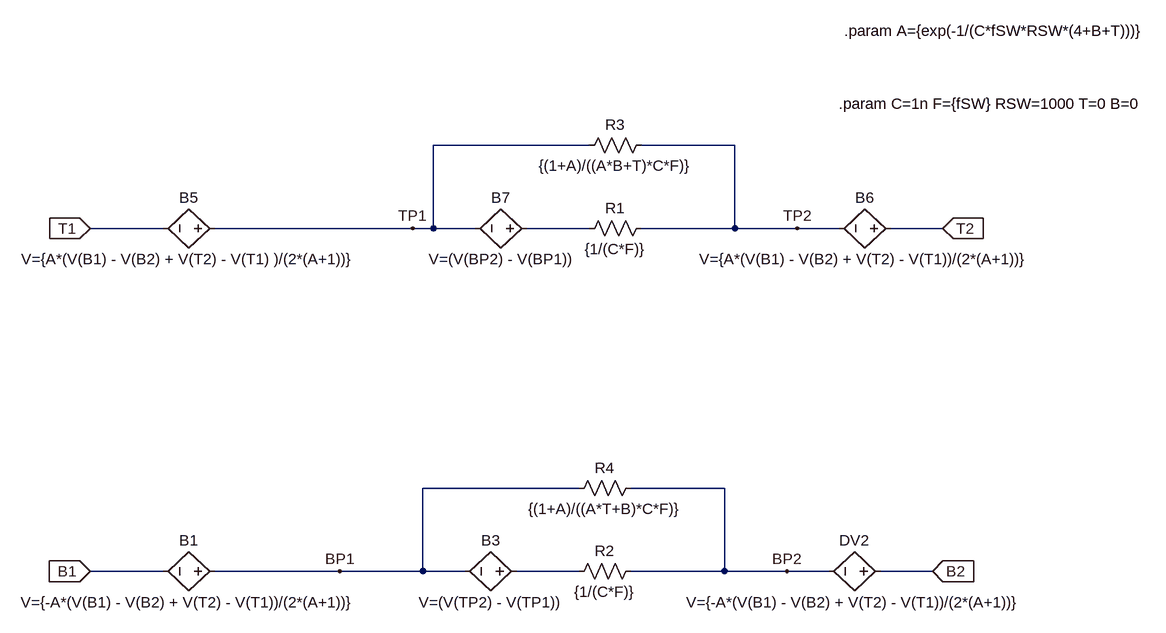
[diagram p0: schematic 4Term_Model.asc]
4Term_Model.asc, the LTspice schematic file:
Version 4
SHEET 1 2172 680
WIRE 352 -336 112 -336
WIRE 576 -336 432 -336
WIRE -304 -208 -416 -208
WIRE 80 -208 -224 -208
WIRE 112 -208 112 -336
WIRE 112 -208 80 -208
WIRE 176 -208 112 -208
WIRE 352 -208 256 -208
WIRE 576 -208 576 -336
WIRE 576 -208 432 -208
WIRE 672 -208 576 -208
WIRE 736 -208 672 -208
WIRE 896 -208 816 -208
WIRE 336 192 96 192
WIRE 560 192 416 192
WIRE -304 320 -416 320
WIRE -32 320 -224 320
WIRE 96 320 96 192
WIRE 96 320 -32 320
WIRE 160 320 96 320
WIRE 336 320 240 320
WIRE 560 320 560 192
WIRE 560 320 416 320
WIRE 656 320 560 320
WIRE 720 320 656 320
WIRE 880 320 800 320
FLAG -416 320 B1
IOPIN -416 320 In
FLAG 880 320 B2
IOPIN 880 320 In
FLAG 656 320 BP2
FLAG -32 320 BP1
FLAG -416 -208 T1
IOPIN -416 -208 In
FLAG 896 -208 T2
IOPIN 896 -208 In
FLAG 672 -208 TP2
FLAG 80 -208 TP1
SYMBOL res 432 304 R90
WINDOW 0 0 56 VBottom 2
WINDOW 3 32 56 VTop 2
SYMATTR InstName R2
SYMATTR Value {1/(C*F)}
SYMBOL bv 256 320 R90
WINDOW 0 -32 56 VBottom 2
WINDOW 3 32 56 VTop 2
SYMATTR InstName B3
SYMATTR Value V=(V(TP2) - V(TP1))
SYMBOL res 448 -224 R90
WINDOW 0 0 56 VBottom 2
WINDOW 3 32 56 VTop 2
SYMATTR InstName R1
SYMATTR Value {1/(C*F)}
SYMBOL bv -208 -208 R90
WINDOW 0 -32 56 VBottom 2
WINDOW 3 32 56 VTop 2
SYMATTR InstName B5
SYMATTR Value V={A*(V(B1) - V(B2) + V(T2) - V(T1) )/(2*(A+1))}
SYMBOL bv 272 -208 R90
WINDOW 0 -32 56 VBottom 2
WINDOW 3 32 56 VTop 2
SYMATTR InstName B7
SYMATTR Value V=(V(BP2) - V(BP1))
SYMBOL bv 832 -208 R90
WINDOW 0 -32 56 VBottom 2
WINDOW 3 32 56 VTop 2
SYMATTR InstName B6
SYMATTR Value V={A*(V(B1) - V(B2) + V(T2) - V(T1))/(2*(A+1))}
SYMBOL bv -208 320 R90
WINDOW 0 -32 56 VBottom 2
WINDOW 3 32 56 VTop 2
SYMATTR InstName B1
SYMATTR Value V={-A*(V(B1) - V(B2) + V(T2) - V(T1))/(2*(A+1))}
SYMBOL bv 816 320 R90
WINDOW 0 -32 56 VBottom 2
WINDOW 3 32 56 VTop 2
SYMATTR InstName DV2
SYMATTR Value V={-A*(V(B1) - V(B2) + V(T2) - V(T1))/(2*(A+1))}
SYMBOL res 448 -352 R90
WINDOW 0 0 56 VBottom 2
WINDOW 3 32 56 VTop 2
SYMATTR InstName R3
SYMATTR Value {(1+A)/((A*B+T)*C*F)}
SYMBOL res 432 176 R90
WINDOW 0 0 56 VBottom 2
WINDOW 3 32 56 VTop 2
SYMATTR InstName R4
SYMATTR Value {(1+A)/((A*T+B)*C*F)}
TEXT 736 -400 Left 2 !.param C=1n F={fSW} RSW=1000 T=0 B=0
TEXT 744 -512 Left 2 !.param A={exp(-1/(C*fSW*RSW*(4+B+T)))}

The netlist it stands for:
* 4Term_Model.asc
R2 BP2 N002 {1/(C*F)}
B3 N002 BP1 V=(V(TP2) - V(TP1))
R1 TP2 N001 {1/(C*F)}
B5 TP1 T1 V={A*(V(B1) - V(B2) + V(T2) - V(T1) )/(2*(A+1))}
B7 N001 TP1 V=(V(BP2) - V(BP1))
B6 T2 TP2 V={A*(V(B1) - V(B2) + V(T2) - V(T1))/(2*(A+1))}
B1 BP1 B1 V={-A*(V(B1) - V(B2) + V(T2) - V(T1))/(2*(A+1))}
B§DV2 B2 BP2 V={-A*(V(B1) - V(B2) + V(T2) - V(T1))/(2*(A+1))}
R3 TP2 TP1 {(1+A)/((A*B+T)*C*F)}
R4 BP2 BP1 {(1+A)/((A*T+B)*C*F)}
.param C=1n F={fSW} RSW=1000 T=0 B=0
.param A={exp(-1/(C*fSW*RSW*(4+B+T)))}
.backanno
.end